# Altium schematic sheet MPC.SchDoc: SysP17_Team10: PIC
size A4; CheckedBy: U. Hauser; Author: N. Dürr / M. Mettler; CompanyName: NTB; Organization: NTB Interstate University of Applied; Address1: Werdenbergstrasse 4; Address3: 9471 Buchs; Address4: Switzerland; SheetNumber: 4; SheetTotal: 5; Organization1: Sciences of Technology Buchs; Size: A4; ShortDescription: Schema des PIC-Anschlusses
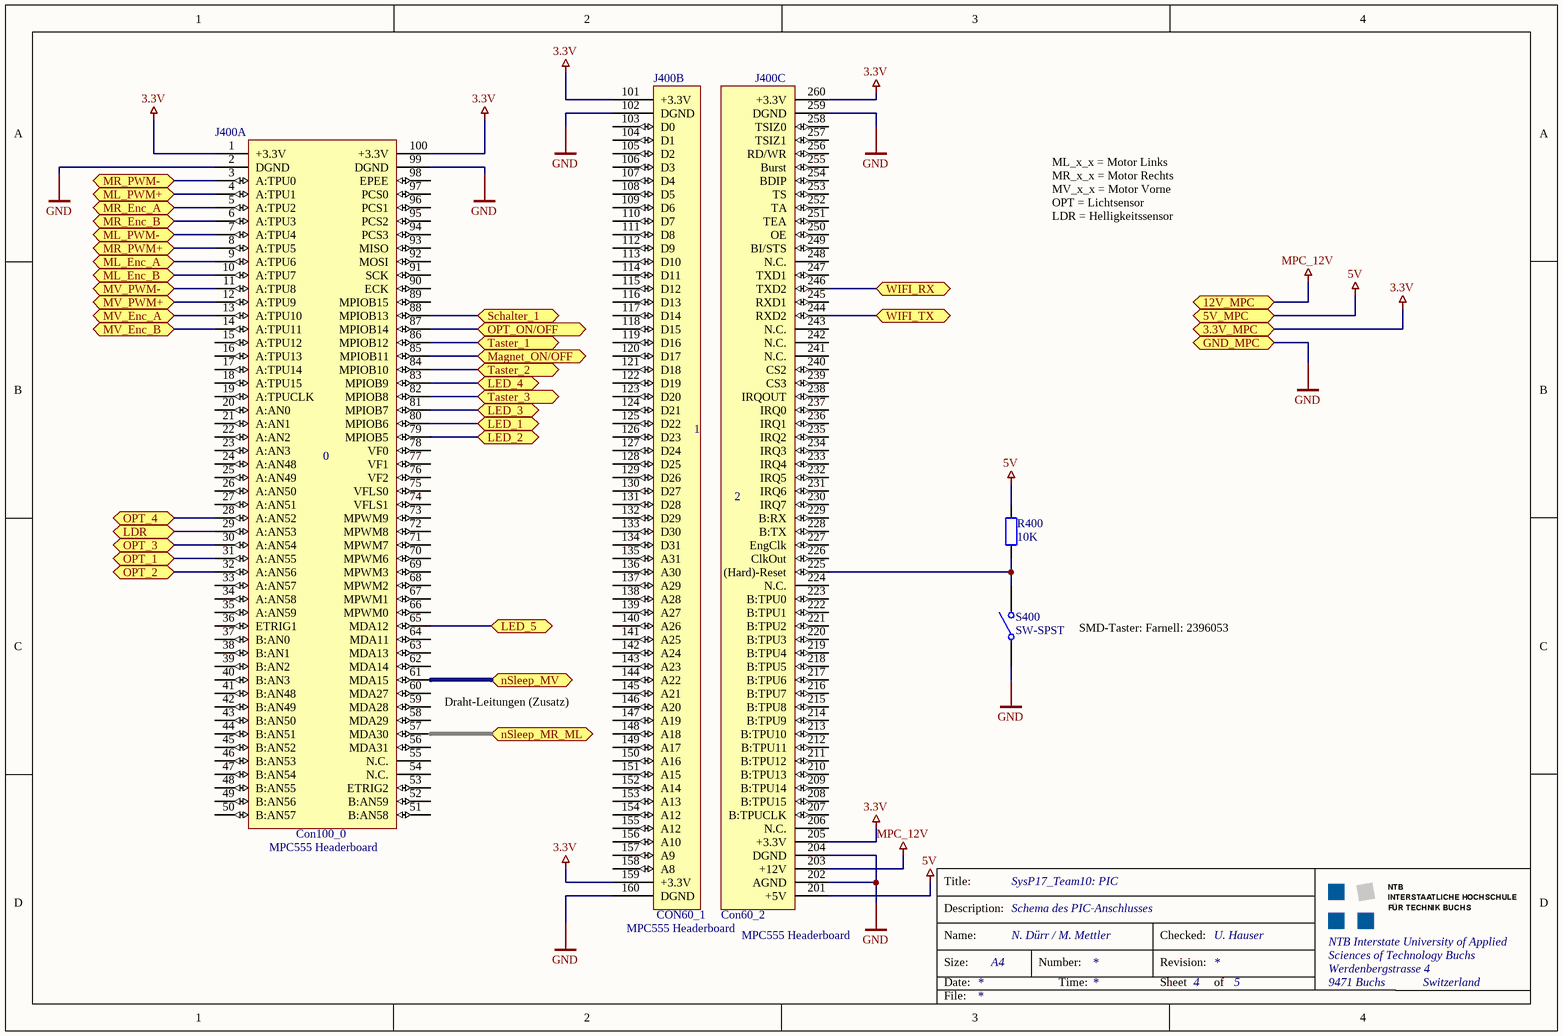
[diagram p0: MPC.SchDoc]

## Parts
J400  MPC555 Headerboard  [MPC555 Headerboard THT]  (parts A,B,C of 3)
R400  value 10K  [GEN_R0805_H]  (hidden comment: Generic)
S400  SW-SPST  [Taster]

## Ports
3.3V_MPC, 5V_MPC, 12V_MPC, GND_MPC, LDR (bidir), LED_1 (bidir), LED_2 (bidir), LED_3 (bidir), LED_4 (bidir), LED_5 (bidir), Magnet_ON/OFF (bidir), ML_Enc_A (bidir), ML_Enc_B (bidir), ML_PWM+ (bidir), ML_PWM- (bidir), MR_Enc_A (bidir), MR_Enc_B (bidir), MR_PWM+ (bidir), MR_PWM- (bidir), MV_Enc_A (bidir), MV_Enc_B (bidir), MV_PWM+ (bidir), MV_PWM- (bidir), nSleep_MR_ML (bidir), nSleep_MV (bidir), OPT_1 (bidir), OPT_2 (bidir), OPT_3 (bidir), OPT_4 (bidir), OPT_ON/OFF (bidir), Schalter_1 (bidir), Taster_1 (bidir), Taster_2 (bidir), Taster_3 (bidir), WIFI_RX (bidir), WIFI_TX (bidir)

## Nets
3.3V: J400.1(+3.3V) J400.100(+3.3V) J400.101(+3.3V) J400.159(+3.3V) J400.205(+3.3V) J400.260(+3.3V) ; port 3.3V_MPC
5V: J400.201(+5V) R400.2 ; port 5V_MPC
GND: J400.2(DGND) J400.99(DGND) J400.102(DGND) J400.160(DGND) J400.202(AGND) J400.204(DGND) J400.259(DGND) S400.1(COMMON) ; port GND_MPC
MPC_12V: J400.203(+12V) ; port 12V_MPC
LDR: J400.29(A:AN53) ; port LDR
LED_1: J400.80(MPIOB6) ; port LED_1
LED_2: J400.79(MPIOB5) ; port LED_2
LED_3: J400.81(MPIOB7) ; port LED_3
LED_4: J400.83(MPIOB9) ; port LED_4
LED_5: J400.65(MDA12) ; port LED_5
Magnet_ON/OFF: J400.85(MPIOB11) ; port Magnet_ON/OFF
ML_Enc_A: J400.9(A:TPU6) ; port ML_Enc_A
ML_Enc_B: J400.10(A:TPU7) ; port ML_Enc_B
ML_PWM+: J400.4(A:TPU1) ; port ML_PWM+
ML_PWM-: J400.7(A:TPU4) ; port ML_PWM-
MR_Enc_A: J400.5(A:TPU2) ; port MR_Enc_A
MR_Enc_B: J400.6(A:TPU3) ; port MR_Enc_B
MR_PWM+: J400.8(A:TPU5) ; port MR_PWM+
MR_PWM-: J400.3(A:TPU0) ; port MR_PWM-
MV_Enc_A: J400.13(A:TPU10) ; port MV_Enc_A
MV_Enc_B: J400.14(A:TPU11) ; port MV_Enc_B
MV_PWM+: J400.12(A:TPU9) ; port MV_PWM+
MV_PWM-: J400.11(A:TPU8) ; port MV_PWM-
nSleep_MR_ML: J400.57(MDA30) ; port nSleep_MR_ML
nSleep_MV: J400.61(MDA15) ; port nSleep_MV
OPT_1: J400.31(A:AN55) ; port OPT_1
OPT_2: J400.32(A:AN56) ; port OPT_2
OPT_3: J400.30(A:AN54) ; port OPT_3
OPT_4: J400.28(A:AN52) ; port OPT_4
OPT_ON/OFF: J400.87(MPIOB14) ; port OPT_ON/OFF
Schalter_1: J400.88(MPIOB13) ; port Schalter_1
Taster_1: J400.86(MPIOB12) ; port Taster_1
Taster_2: J400.84(MPIOB10) ; port Taster_2
Taster_3: J400.82(MPIOB8) ; port Taster_3
WIFI_RX: J400.246(TXD2) ; port WIFI_RX
WIFI_TX: J400.244(RXD2) ; port WIFI_TX
NetJ400_225: J400.225((Hard)-Reset) R400.1 S400.0(NO)

Not connected (* = marked no-connect by the designer): J400 15(A:TPU12) 16(A:TPU13) 17(A:TPU14) 18(A:TPU15) 19(A:TPUCLK) 20(A:AN0) 21(A:AN1) 22(A:AN2) 23(A:AN3) 24(A:AN48) 25(A:AN49) 26(A:AN50) 27(A:AN51) 33(A:AN57) 34(A:AN58) 35(A:AN59) 36(ETRIG1) 37(B:AN0) 38(B:AN1) 39(B:AN2) 40(B:AN3) 41(B:AN48) 42(B:AN49) 43(B:AN50) 44(B:AN51) 45(B:AN52) 46(B:AN53) 47(B:AN54) 48(B:AN55) 49(B:AN56) 50(B:AN57) 51(B:AN58) 52(B:AN59) 53(ETRIG2) 54(N.C.) 55(N.C.) 56(MDA31) 58(MDA29) 59(MDA28) 60(MDA27) 62(MDA14) 63(MDA13) 64(MDA11) 66(MPWM0) 67(MPWM1) 68(MPWM2) 69(MPWM3) 70(MPWM6) 71(MPWM7) 72(MPWM8) 73(MPWM9) 74(VFLS1) 75(VFLS0) 76(VF2) 77(VF1) 78(VF0) 89(MPIOB15) 90(ECK) 91(SCK) 92(MOSI) 93(MISO) 94(PCS3) 95(PCS2) 96(PCS1) 97(PCS0) 98(EPEE) 103(D0) 104(D1) 105(D2) 106(D3) 107(D4) 108(D5) 109(D6) 110(D7) 111(D8) 112(D9) 113(D10) 114(D11) 115(D12) 116(D13) 117(D14) 118(D15) 119(D16) 120(D17) 121(D18) 122(D19) 123(D20) 124(D21) 125(D22) 126(D23) 127(D24) 128(D25) 129(D26) 130(D27) 131(D28) 132(D29) 133(D30) 134(D31) 135(A31) 136(A30) 137(A29) 138(A28) 139(A27) 140(A26) 141(A25) 142(A24) 143(A23) 144(A22) 145(A21) 146(A20) 147(A19) 148(A18) 149(A17) 150(A16) 151(A15) 152(A14) 153(A13) 154(A12) 155(A12) 156(A10) 157(A9) 158(A8) 206(N.C.) 207(B:TPUCLK) 208(B:TPU15) 209(B:TPU14) 210(B:TPU13) 211(B:TPU12) 212(B:TPU11) 213(B:TPU10) 214(B:TPU9) 215(B:TPU8) 216(B:TPU7) 217(B:TPU6) 218(B:TPU5) 219(B:TPU4) 220(B:TPU3) 221(B:TPU2) 222(B:TPU1) 223(B:TPU0) 224(N.C.) 226(ClkOut) 227(EngClk) 228(B:TX) 229(B:RX) 230(IRQ7) 231(IRQ6) 232(IRQ5) 233(IRQ4) 234(IRQ3) 235(IRQ2) 236(IRQ1) 237(IRQ0) 238(IRQOUT) 239(CS3) 240(CS2) 241(N.C.) 242(N.C.) 243(N.C.) 245(RXD1) 247(TXD1) 248(N.C.) 249(BI/STS) 250(OE) 251(TEA) 252(TA) 253(TS) 254(BDIP) 255(Burst) 256(RD/WR) 257(TSIZ1) 258(TSIZ0)

## Notes on the sheet
- ML_x_x = Motor Links
  MR_x_x = Motor Rechts
  MV_x_x = Motor Vorne
  OPT = Lichtsensor
  LDR = Helligkeitssensor
- SMD-Taster: Farnell: 2396053
- (near J400) Draht-Leitungen (Zusatz)
- Title:
- Description:
- Size:
- Date:
- Name:
- Number:
- Time:
- Revision:
- Sheet
- Checked:
- of
- File:
- (in symbol MPC555 Headerboard, part A) 0; Con100_0
- (in symbol MPC555 Headerboard, part B) CON60_1
- (in symbol MPC555 Headerboard, part C) Con60_2

## Library data of the parts
J400 = MPC555 Headerboard: NTB MPC555 Headerboard
R400 = GEN_R_2: generic resistor; Manufacturer: Tbd; #Class: PASSIVE; Published: 8-Jun-2000; Publisher: Altium Limited; #ClassSub: RESISTOR; ComponentLink1Description: Manufacturer Link; ComponentLink2Description: Datasheet; ComponentLink3Description: Packaging Specification; Distributor: tbd; RefFootprint: GEN_R0805_H; Manufacturer PartNr: tbd; Distributor PartNr: tbd; RefFileFOO: *; RefFileSCH: *; RefSchema: GEN_R_2
S400 = SW-SPST: Single-Pole, Single-Throw Switch; Published: 24-Mar-1999; LatestRevisionDate: 17-Jul-2002; LatestRevisionNote: Re-released for DXP Platform.; PackageReference: SPST-2; Publisher: Altium Limited; PackageDescription: Switch; 2 Leads